# Altium schematic sheet SOC_DDR.schdoc: =
size A3; Symbol: Sheet-Symbol_A4; Company: 嘉立创EDA; Version: V1.0; Page Size: A4; @Project Name: RK3568B2地瓜派; @Page Count: 27; @Update Date: 2025-09-11; @Create Date: 2025-09-11; @Schematic Name: Schematic1; @Page No: 6; @Page Name: SOC_DDR; Device: Sheet-Symbol_A4; Border: 1; Title Block Position: 3; Width: 1655; Height: 1170; Region Start: 1; X Region Count: 6; Y Region Count: 4; Blade Width: 10; @Board Name: Board1; @Create Time: 22:14:45; @Update Time: 22:15:05; Organization: ORGANIZATION; Address1: ADDRESS 1; Address2: ADDRESS 2; Address3: ADDRESS 3; Address4: ADDRESS 4; SheetNumber: 11; SheetTotal: 28
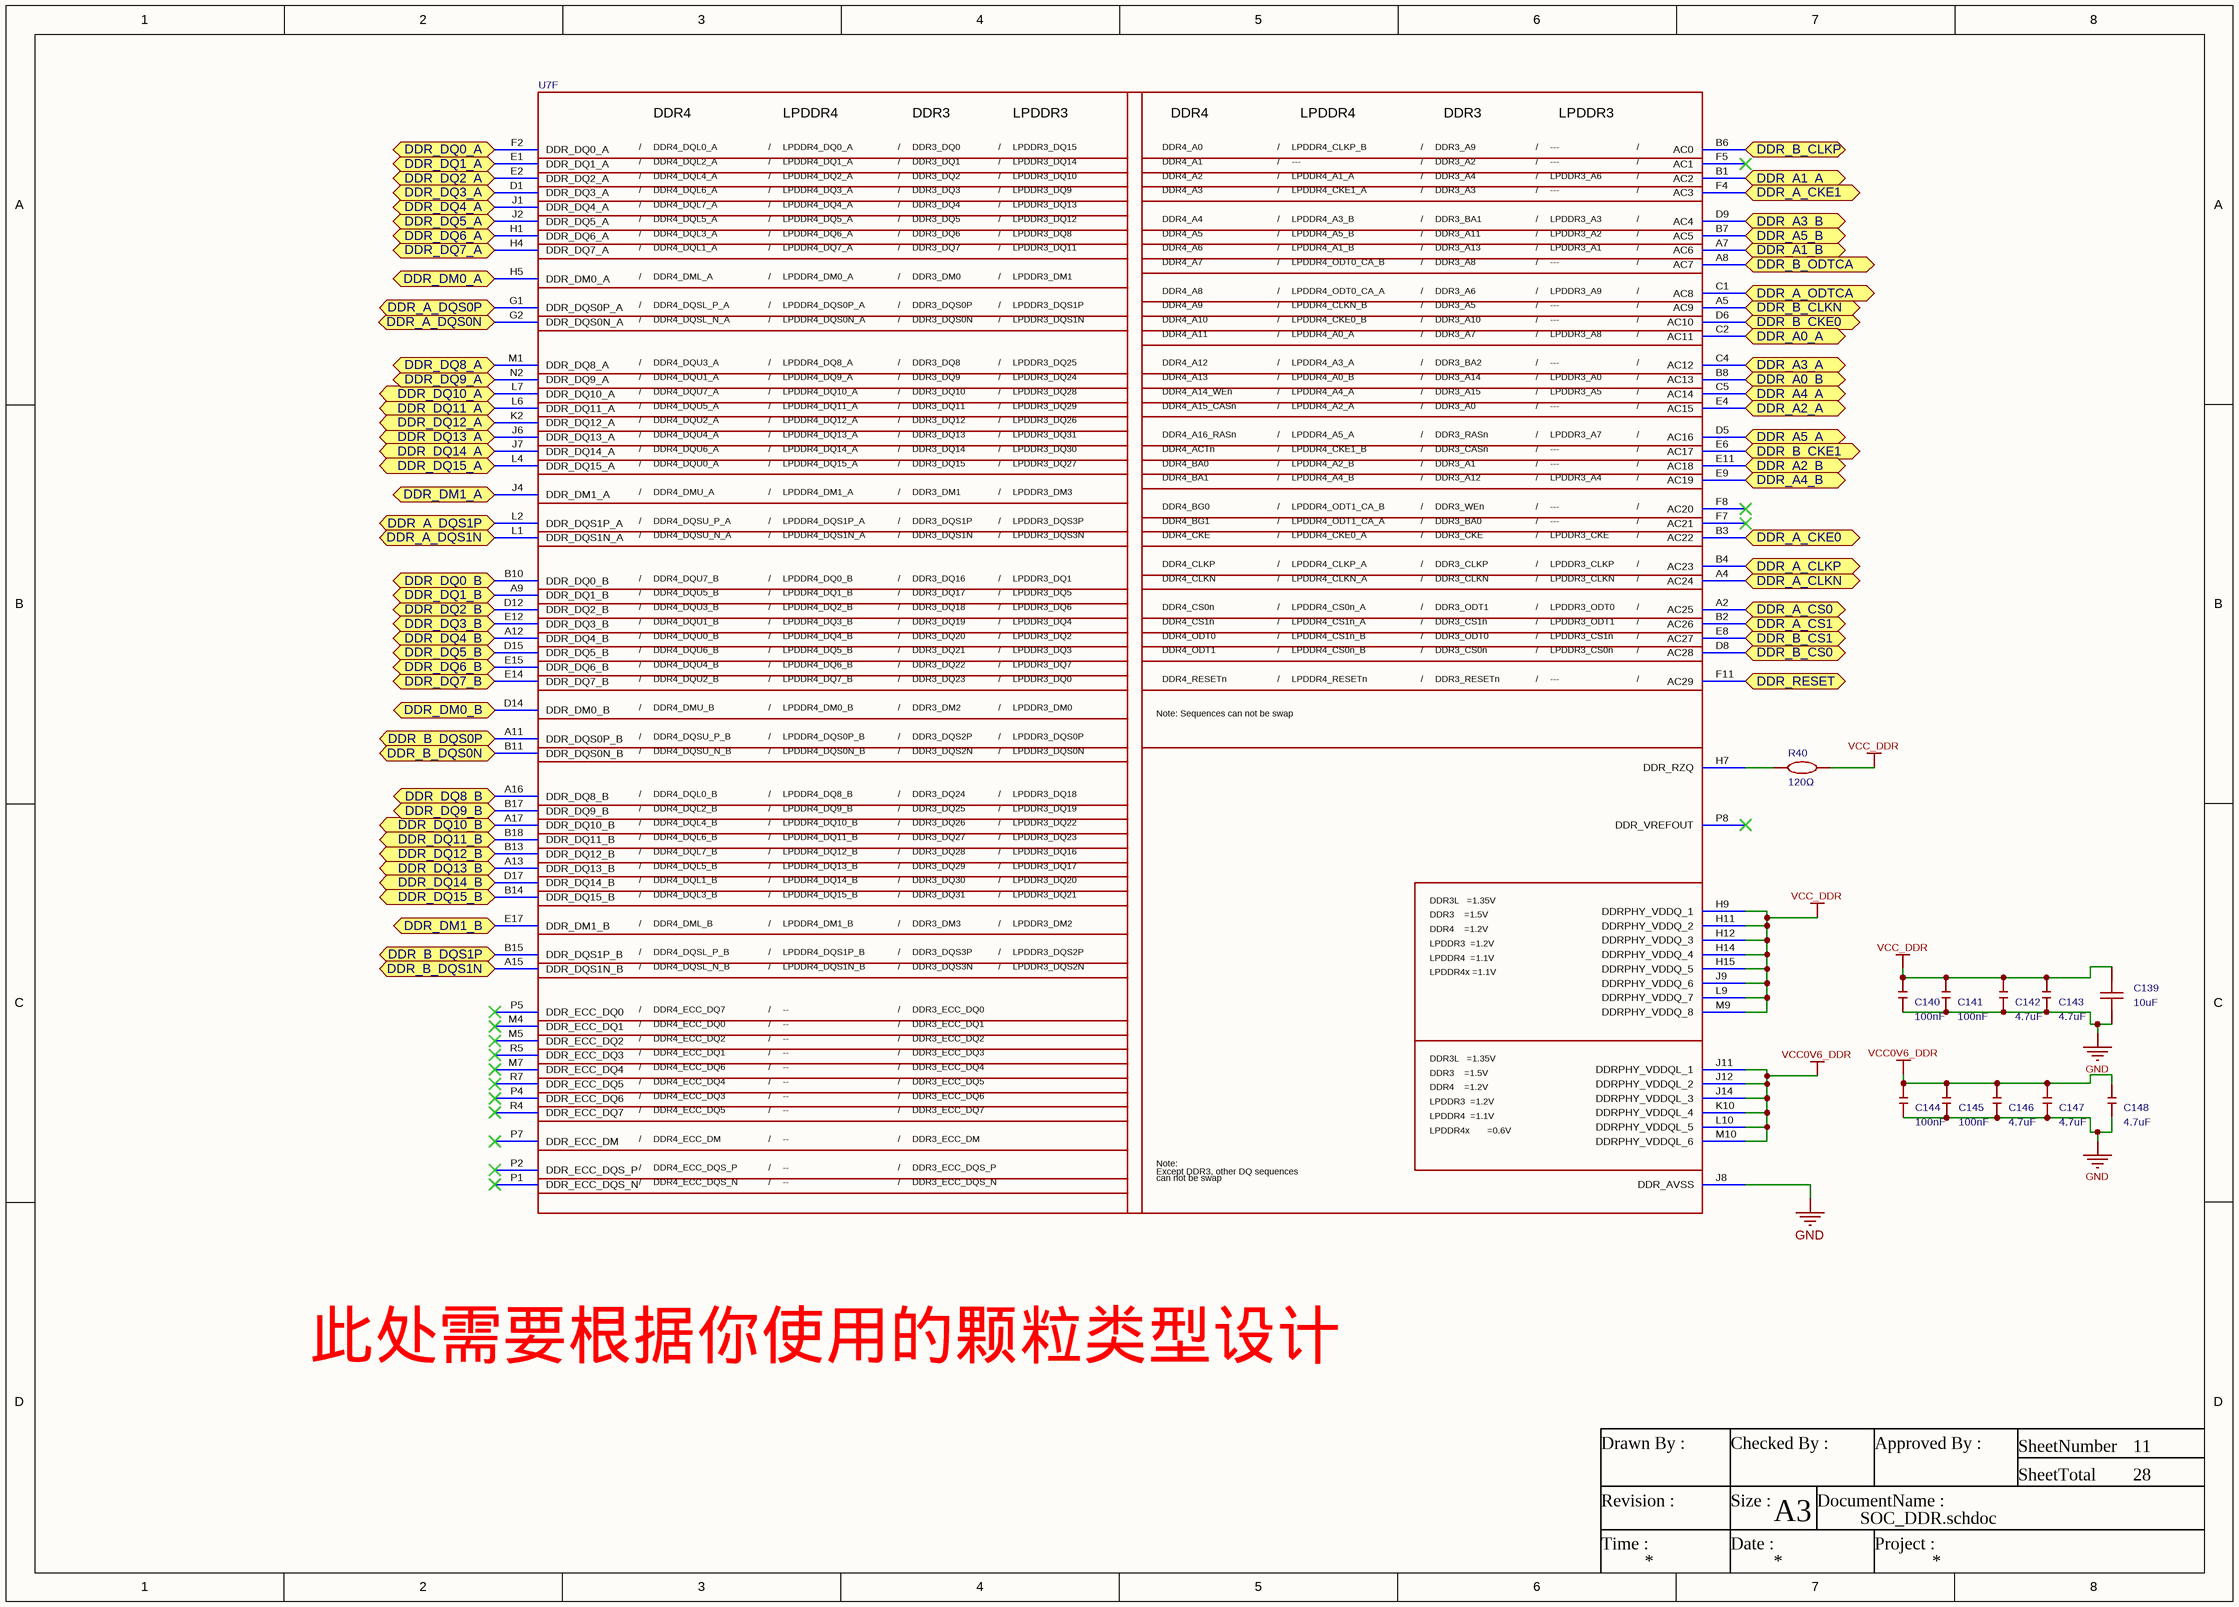
[diagram p0: SOC_DDR.schdoc]

## Parts
C139  10uF  [C0603]
C140  100nF  [MYC0201]
C141  100nF  [MYC0201]
C142  4.7uF  [MYC0402]
C143  4.7uF  [MYC0402]
C144  100nF  [MYC0201]
C145  100nF  [MYC0201]
C146  4.7uF  [MYC0402]
C147  4.7uF  [MYC0402]
C148  4.7uF  [MYC0402]
R40  120Ω  [R0201]
U7  RK3568  [BGA-636_L19.0-W19.0-P0.65-BL]  (value not drawn)  (part F of 23)

## Ports
DDR_A0_A (bidir), DDR_A0_B (bidir), DDR_A1_A (bidir), DDR_A1_B (bidir), DDR_A2_A (bidir), DDR_A2_B (bidir), DDR_A3_A (bidir), DDR_A3_B (bidir), DDR_A4_A (bidir), DDR_A4_B (bidir), DDR_A5_A (bidir), DDR_A5_B (bidir), DDR_A_CKE0 (bidir), DDR_A_CKE1 (bidir), DDR_A_CLKN (bidir), DDR_A_CLKP (bidir), DDR_A_CS0 (bidir), DDR_A_CS1 (bidir), DDR_A_DQS0N (bidir), DDR_A_DQS0P (bidir), DDR_A_DQS1N (bidir), DDR_A_DQS1P (bidir), DDR_A_ODTCA (bidir), DDR_B_CKE0 (bidir), DDR_B_CKE1 (bidir), DDR_B_CLKN (bidir), DDR_B_CLKP (bidir), DDR_B_CS0 (bidir), DDR_B_CS1 (bidir), DDR_B_DQS0N (bidir), DDR_B_DQS0P (bidir), DDR_B_DQS1N (bidir), DDR_B_DQS1P (bidir), DDR_B_ODTCA (bidir), DDR_DM0_A (bidir), DDR_DM0_B (bidir), DDR_DM1_A (bidir), DDR_DM1_B (bidir), DDR_DQ0_A (bidir), DDR_DQ0_B (bidir), DDR_DQ1_A (bidir), DDR_DQ1_B (bidir), DDR_DQ2_A (bidir), DDR_DQ2_B (bidir), DDR_DQ3_A (bidir), DDR_DQ3_B (bidir), DDR_DQ4_A (bidir), DDR_DQ4_B (bidir), DDR_DQ5_A (bidir), DDR_DQ5_B (bidir), DDR_DQ6_A (bidir), DDR_DQ6_B (bidir), DDR_DQ7_A (bidir), DDR_DQ7_B (bidir), DDR_DQ8_A (bidir), DDR_DQ8_B (bidir), DDR_DQ9_A (bidir), DDR_DQ9_B (bidir), DDR_DQ10_A (bidir), DDR_DQ10_B (bidir), DDR_DQ11_A (bidir), DDR_DQ11_B (bidir), DDR_DQ12_A (bidir), DDR_DQ12_B (bidir), DDR_DQ13_A (bidir), DDR_DQ13_B (bidir), DDR_DQ14_A (bidir), DDR_DQ14_B (bidir), DDR_DQ15_A (bidir), DDR_DQ15_B (bidir), DDR_RESET (bidir)

## Nets
GND: C139.1 C140.1 C141.1 C142.1 C143.1 C144.1 C145.1 C146.1 C147.1 C148.1 U7.J8(DDR_AVSS)
VCC0V6_DDR: C144.2 C145.2 C146.2 C147.2 C148.2 U7.J11(DDRPHY_VDDQL_1) U7.J12(DDRPHY_VDDQL_2) U7.J14(DDRPHY_VDDQL_3) U7.K10(DDRPHY_VDDQL_4) U7.L10(DDRPHY_VDDQL_5) U7.M10(DDRPHY_VDDQL_6)
VCC_DDR: C139.2 C140.2 C141.2 C142.2 C143.2 R40.2 U7.H9(DDRPHY_VDDQ_1) U7.H11(DDRPHY_VDDQ_2) U7.H12(DDRPHY_VDDQ_3) U7.H14(DDRPHY_VDDQ_4) U7.H15(DDRPHY_VDDQ_5) U7.J9(DDRPHY_VDDQ_6) U7.L9(DDRPHY_VDDQ_7) U7.M9(DDRPHY_VDDQ_8)
DDR_A0_A: U7.C2(AC11) ; port DDR_A0_A
DDR_A0_B: U7.B8(AC13) ; port DDR_A0_B
DDR_A1_A: U7.B1(AC2) ; port DDR_A1_A
DDR_A1_B: U7.A7(AC6) ; port DDR_A1_B
DDR_A2_A: U7.E4(AC15) ; port DDR_A2_A
DDR_A2_B: U7.E11(AC18) ; port DDR_A2_B
DDR_A3_A: U7.C4(AC12) ; port DDR_A3_A
DDR_A3_B: U7.D9(AC4) ; port DDR_A3_B
DDR_A4_A: U7.C5(AC14) ; port DDR_A4_A
DDR_A4_B: U7.E9(AC19) ; port DDR_A4_B
DDR_A5_A: U7.D5(AC16) ; port DDR_A5_A
DDR_A5_B: U7.B7(AC5) ; port DDR_A5_B
DDR_A_CKE0: U7.B3(AC22) ; port DDR_A_CKE0
DDR_A_CKE1: U7.F4(AC3) ; port DDR_A_CKE1
DDR_A_CLKN: U7.A4(AC24) ; port DDR_A_CLKN
DDR_A_CLKP: U7.B4(AC23) ; port DDR_A_CLKP
DDR_A_CS0: U7.A2(AC25) ; port DDR_A_CS0
DDR_A_CS1: U7.B2(AC26) ; port DDR_A_CS1
DDR_A_DQS0N: U7.G2(DDR_DQS0N_A) ; port DDR_A_DQS0N
DDR_A_DQS0P: U7.G1(DDR_DQS0P_A) ; port DDR_A_DQS0P
DDR_A_DQS1N: U7.L1(DDR_DQS1N_A) ; port DDR_A_DQS1N
DDR_A_DQS1P: U7.L2(DDR_DQS1P_A) ; port DDR_A_DQS1P
DDR_A_ODTCA: U7.C1(AC8) ; port DDR_A_ODTCA
DDR_B_CKE0: U7.D6(AC10) ; port DDR_B_CKE0
DDR_B_CKE1: U7.E6(AC17) ; port DDR_B_CKE1
DDR_B_CLKN: U7.A5(AC9) ; port DDR_B_CLKN
DDR_B_CLKP: U7.B6(AC0) ; port DDR_B_CLKP
DDR_B_CS0: U7.D8(AC28) ; port DDR_B_CS0
DDR_B_CS1: U7.E8(AC27) ; port DDR_B_CS1
DDR_B_DQS0N: U7.B11(DDR_DQS0N_B) ; port DDR_B_DQS0N
DDR_B_DQS0P: U7.A11(DDR_DQS0P_B) ; port DDR_B_DQS0P
DDR_B_DQS1N: U7.A15(DDR_DQS1N_B) ; port DDR_B_DQS1N
DDR_B_DQS1P: U7.B15(DDR_DQS1P_B) ; port DDR_B_DQS1P
DDR_B_ODTCA: U7.A8(AC7) ; port DDR_B_ODTCA
DDR_DM0_A: U7.H5(DDR_DM0_A) ; port DDR_DM0_A
DDR_DM0_B: U7.D14(DDR_DM0_B) ; port DDR_DM0_B
DDR_DM1_A: U7.J4(DDR_DM1_A) ; port DDR_DM1_A
DDR_DM1_B: U7.E17(DDR_DM1_B) ; port DDR_DM1_B
DDR_DQ0_A: U7.F2(DDR_DQ0_A) ; port DDR_DQ0_A
DDR_DQ0_B: U7.B10(DDR_DQ0_B) ; port DDR_DQ0_B
DDR_DQ1_A: U7.E1(DDR_DQ1_A) ; port DDR_DQ1_A
DDR_DQ1_B: U7.A9(DDR_DQ1_B) ; port DDR_DQ1_B
DDR_DQ2_A: U7.E2(DDR_DQ2_A) ; port DDR_DQ2_A
DDR_DQ2_B: U7.D12(DDR_DQ2_B) ; port DDR_DQ2_B
DDR_DQ3_A: U7.D1(DDR_DQ3_A) ; port DDR_DQ3_A
DDR_DQ3_B: U7.E12(DDR_DQ3_B) ; port DDR_DQ3_B
DDR_DQ4_A: U7.J1(DDR_DQ4_A) ; port DDR_DQ4_A
DDR_DQ4_B: U7.A12(DDR_DQ4_B) ; port DDR_DQ4_B
DDR_DQ5_A: U7.J2(DDR_DQ5_A) ; port DDR_DQ5_A
DDR_DQ5_B: U7.D15(DDR_DQ5_B) ; port DDR_DQ5_B
DDR_DQ6_A: U7.H1(DDR_DQ6_A) ; port DDR_DQ6_A
DDR_DQ6_B: U7.E15(DDR_DQ6_B) ; port DDR_DQ6_B
DDR_DQ7_A: U7.H4(DDR_DQ7_A) ; port DDR_DQ7_A
DDR_DQ7_B: U7.E14(DDR_DQ7_B) ; port DDR_DQ7_B
DDR_DQ8_A: U7.M1(DDR_DQ8_A) ; port DDR_DQ8_A
DDR_DQ8_B: U7.A16(DDR_DQ8_B) ; port DDR_DQ8_B
DDR_DQ9_A: U7.N2(DDR_DQ9_A) ; port DDR_DQ9_A
DDR_DQ9_B: U7.B17(DDR_DQ9_B) ; port DDR_DQ9_B
DDR_DQ10_A: U7.L7(DDR_DQ10_A) ; port DDR_DQ10_A
DDR_DQ10_B: U7.A17(DDR_DQ10_B) ; port DDR_DQ10_B
DDR_DQ11_A: U7.L6(DDR_DQ11_A) ; port DDR_DQ11_A
DDR_DQ11_B: U7.B18(DDR_DQ11_B) ; port DDR_DQ11_B
DDR_DQ12_A: U7.K2(DDR_DQ12_A) ; port DDR_DQ12_A
DDR_DQ12_B: U7.B13(DDR_DQ12_B) ; port DDR_DQ12_B
DDR_DQ13_A: U7.J6(DDR_DQ13_A) ; port DDR_DQ13_A
DDR_DQ13_B: U7.A13(DDR_DQ13_B) ; port DDR_DQ13_B
DDR_DQ14_A: U7.J7(DDR_DQ14_A) ; port DDR_DQ14_A
DDR_DQ14_B: U7.D17(DDR_DQ14_B) ; port DDR_DQ14_B
DDR_DQ15_A: U7.L4(DDR_DQ15_A) ; port DDR_DQ15_A
DDR_DQ15_B: U7.B14(DDR_DQ15_B) ; port DDR_DQ15_B
DDR_RESET: U7.F11(AC29) ; port DDR_RESET
NetR40_1: R40.1 U7.H7(DDR_RZQ)

Not connected (* = marked no-connect by the designer): U7 F5(AC1)* F7(AC21)* F8(AC20)* M4(DDR_ECC_DQ1)* M5(DDR_ECC_DQ2)* M7(DDR_ECC_DQ4)* P1(DDR_ECC_DQS_N)* P2(DDR_ECC_DQS_P)* P4(DDR_ECC_DQ6)* P5(DDR_ECC_DQ0)* P7(DDR_ECC_DM)* P8(DDR_VREFOUT)* R4(DDR_ECC_DQ7)* R5(DDR_ECC_DQ3)* R7(DDR_ECC_DQ5)*

## Notes on the sheet
- 此处需要根据你使用的颗粒类型设计
- Drawn By :
- Checked By :
- Approved By :
- SheetNumber
- SheetTotal
- Revision :
- Time :
- Size :
- Date :
- A3
- DocumentName :
- Project :
- (in symbol RK3568, part F) DDR4; LPDDR4; DDR3; LPDDR3; /; DDR4_DQL0_A; LPDDR4_DQ0_A; DDR3_DQ0; LPDDR3_DQ15; DDR4_A0; LPDDR4_CLKP_B; DDR3_A9; ---; DDR4_DQL2_A; LPDDR4_DQ1_A; DDR3_DQ1; LPDDR3_DQ14; DDR4_A1; DDR3_A2; DDR4_DQL4_A; LPDDR4_DQ2_A; DDR3_DQ2; LPDDR3_DQ10; DDR4_A2; LPDDR4_A1_A; DDR3_A4; LPDDR3_A6; DDR4_DQL6_A; LPDDR4_DQ3_A; DDR3_DQ3; LPDDR3_DQ9; DDR4_A3; LPDDR4_CKE1_A; DDR3_A3; DDR4_DQL7_A; LPDDR4_DQ4_A; DDR3_DQ4; LPDDR3_DQ13; DDR4_DQL5_A; LPDDR4_DQ5_A; DDR3_DQ5; LPDDR3_DQ12; DDR4_A4; LPDDR4_A3_B; DDR3_BA1; LPDDR3_A3; DDR4_DQL3_A; LPDDR4_DQ6_A; DDR3_DQ6; LPDDR3_DQ8; DDR4_A5; LPDDR4_A5_B; DDR3_A11; LPDDR3_A2; DDR4_DQL1_A; LPDDR4_DQ7_A; DDR3_DQ7; LPDDR3_DQ11; DDR4_A6; LPDDR4_A1_B; DDR3_A13; LPDDR3_A1; DDR4_A7; LPDDR4_ODT0_CA_B; DDR3_A8; DDR4_DML_A; LPDDR4_DM0_A; DDR3_DM0; LPDDR3_DM1; DDR4_A8; LPDDR4_ODT0_CA_A; DDR3_A6; LPDDR3_A9; DDR4_DQSL_P_A; LPDDR4_DQS0P_A; DDR3_DQS0P; LPDDR3_DQS1P; DDR4_A9; LPDDR4_CLKN_B; DDR3_A5; DDR4_DQSL_N_A; LPDDR4_DQS0N_A; DDR3_DQS0N; LPDDR3_DQS1N; DDR4_A10; LPDDR4_CKE0_B; DDR3_A10; DDR4_A11; LPDDR4_A0_A; DDR3_A7; LPDDR3_A8; DDR4_DQU3_A; LPDDR4_DQ8_A; DDR3_DQ8; LPDDR3_DQ25; DDR4_A12; LPDDR4_A3_A; DDR3_BA2; DDR4_DQU1_A; LPDDR4_DQ9_A; DDR3_DQ9; LPDDR3_DQ24; DDR4_A13; LPDDR4_A0_B; DDR3_A14; LPDDR3_A0; DDR4_DQU7_A; LPDDR4_DQ10_A; DDR3_DQ10; LPDDR3_DQ28; DDR4_A14_WEn; LPDDR4_A4_A; DDR3_A15; LPDDR3_A5; DDR4_DQU5_A; LPDDR4_DQ11_A; DDR3_DQ11; LPDDR3_DQ29; DDR4_A15_CASn; LPDDR4_A2_A; DDR3_A0; DDR4_DQU2_A; LPDDR4_DQ12_A; DDR3_DQ12; LPDDR3_DQ26; DDR4_DQU4_A; LPDDR4_DQ13_A; DDR3_DQ13; LPDDR3_DQ31; DDR4_A16_RASn; LPDDR4_A5_A; DDR3_RASn; LPDDR3_A7; DDR4_DQU6_A; LPDDR4_DQ14_A; DDR3_DQ14; LPDDR3_DQ30; DDR4_ACTn; LPDDR4_CKE1_B; DDR3_CASn; DDR4_DQU0_A; LPDDR4_DQ15_A; DDR3_DQ15; LPDDR3_DQ27; DDR4_BA0; LPDDR4_A2_B; DDR3_A1; DDR4_BA1; LPDDR4_A4_B; DDR3_A12; LPDDR3_A4; DDR4_DMU_A; LPDDR4_DM1_A; DDR3_DM1; LPDDR3_DM3; DDR4_BG0; LPDDR4_ODT1_CA_B; DDR3_WEn; DDR4_DQSU_P_A; LPDDR4_DQS1P_A; DDR3_DQS1P; LPDDR3_DQS3P; DDR4_BG1; LPDDR4_ODT1_CA_A; DDR3_BA0; DDR4_DQSU_N_A; LPDDR4_DQS1N_A; DDR3_DQS1N; LPDDR3_DQS3N; DDR4_CKE; LPDDR4_CKE0_A; DDR3_CKE; LPDDR3_CKE; DDR4_CLKP; LPDDR4_CLKP_A; DDR3_CLKP; LPDDR3_CLKP; DDR4_DQU7_B; LPDDR4_DQ0_B; DDR3_DQ16; LPDDR3_DQ1; DDR4_CLKN; LPDDR4_CLKN_A; DDR3_CLKN; LPDDR3_CLKN; DDR4_DQU5_B; LPDDR4_DQ1_B; DDR3_DQ17; LPDDR3_DQ5; DDR4_DQU3_B; LPDDR4_DQ2_B; DDR3_DQ18; LPDDR3_DQ6; DDR4_CS0n; LPDDR4_CS0n_A; DDR3_ODT1; LPDDR3_ODT0; DDR4_DQU1_B; LPDDR4_DQ3_B; DDR3_DQ19; LPDDR3_DQ4; DDR4_CS1n; LPDDR4_CS1n_A; DDR3_CS1n; LPDDR3_ODT1; DDR4_DQU0_B; LPDDR4_DQ4_B; DDR3_DQ20; LPDDR3_DQ2; DDR4_ODT0; LPDDR4_CS1n_B; DDR3_ODT0; LPDDR3_CS1n; DDR4_DQU6_B; LPDDR4_DQ5_B; DDR3_DQ21; LPDDR3_DQ3; DDR4_ODT1; LPDDR4_CS0n_B; DDR3_CS0n; LPDDR3_CS0n; DDR4_DQU4_B; LPDDR4_DQ6_B; DDR3_DQ22; LPDDR3_DQ7; DDR4_DQU2_B; LPDDR4_DQ7_B; DDR3_DQ23; LPDDR3_DQ0; DDR4_RESETn; LPDDR4_RESETn; DDR3_RESETn; DDR4_DMU_B; LPDDR4_DM0_B; DDR3_DM2; LPDDR3_DM0; Note: Sequences can not be swap; DDR4_DQSU_P_B; LPDDR4_DQS0P_B; DDR3_DQS2P; LPDDR3_DQS0P; DDR4_DQSU_N_B; LPDDR4_DQS0N_B; DDR3_DQS2N; LPDDR3_DQS0N; DDR4_DQL0_B; LPDDR4_DQ8_B; DDR3_DQ24; LPDDR3_DQ18; DDR4_DQL2_B; LPDDR4_DQ9_B; DDR3_DQ25; LPDDR3_DQ19; DDR4_DQL4_B; LPDDR4_DQ10_B; DDR3_DQ26; LPDDR3_DQ22; DDR4_DQL6_B; LPDDR4_DQ11_B; DDR3_DQ27; LPDDR3_DQ23; DDR4_DQL7_B; LPDDR4_DQ12_B; DDR3_DQ28; LPDDR3_DQ16; DDR4_DQL5_B; LPDDR4_DQ13_B; DDR3_DQ29; LPDDR3_DQ17; DDR4_DQL1_B; LPDDR4_DQ14_B; DDR3_DQ30; LPDDR3_DQ20; DDR4_DQL3_B; LPDDR4_DQ15_B; DDR3_DQ31; LPDDR3_DQ21; DDR3L   =1.35V; DDR3    =1.5V; DDR4_DML_B; LPDDR4_DM1_B; DDR3_DM3; LPDDR3_DM2; DDR4    =1.2V; LPDDR3  =1.2V; DDR4_DQSL_P_B; LPDDR4_DQS1P_B; DDR3_DQS3P; LPDDR3_DQS2P; LPDDR4  =1.1V; DDR4_DQSL_N_B; LPDDR4_DQS1N_B; DDR3_DQS3N; LPDDR3_DQS2N; LPDDR4x =1.1V; DDR4_ECC_DQ7; --; DDR3_ECC_DQ0; DDR4_ECC_DQ0; DDR3_ECC_DQ1; DDR4_ECC_DQ2; DDR3_ECC_DQ2; DDR4_ECC_DQ1; DDR3_ECC_DQ3; DDR4_ECC_DQ6; DDR3_ECC_DQ4; DDR4_ECC_DQ4; DDR3_ECC_DQ5; DDR4_ECC_DQ3; DDR3_ECC_DQ6; DDR4_ECC_DQ5; DDR3_ECC_DQ7; LPDDR4x; DDR4_ECC_DM; DDR3_ECC_DM; Note:; DDR4_ECC_DQS_P; DDR3_ECC_DQS_P; Except DDR3, other DQ sequences; can not be swap; DDR4_ECC_DQS_N; DDR3_ECC_DQS_N

## Library data of the parts
C139 = CAP_0603: Symbol: Capacitance; 3D Model: ac125912035d415993ca9572d50418b1聨0819f05c4eef4c71ace90d822a990e87; 3D Model Transform: 62.992,31.496,0,0,0,0,0,0,0; ConvertToPcb: yes; ModelName: C0603_L1.6-W0.8-H0.8; Device: CAP_0603; Supplier Footprint: 0603; Value: 10uF; AddInBom: yes; FootprintName: C0603
C140 C141 C144 C145 = MY_C0201: my0201; AddInBom: yes; ModelId: 7899b263465b4be781422057da338961聨0819f05c4eef4c71ace90d822a990e87; ModelName: C0201; ModelTransform: 23.622000938653944,11.811000469326972,11.811000469326972,0,0,0,0,0,0; Symbol: MY_C0201; Device: MY_C0201; Value: 100nF; FootprintName: MYC0201; ConvertToPcb: yes
C142 C143 C146-C148 = MYC0402: C0402电容; Symbol: MY_C0201; AddInBom: yes; Device: MYC0402; Value: 4.7uF; ConvertToPcb: yes; FootprintName: MYC0402
R40 = Res_0201: Symbol: 电阻; 3D Model: 0e006ba4c37b4b73b0e85d5d1c6800cb; 3D Model Transform: 23.622,11.811,0,0,0,0,0,-0.0005,0; ConvertToPcb: yes; ModelName: R0201_L0.6-W0.3-H0.3; Device: Res_0201; Supplier Footprint: 0201; Value: 120Ω; AddInBom: yes; FootprintName: R0201
U7 = RK3568: ConvertToPcb: yes; ModelId: e6756cba1b9f43448429fdcd1d44d9d9; ModelTransform: 748.03,748.03,54.33,0,0,0,0,0,0; Symbol: RK3568; Device: RK3568; AddInBom: yes; FootprintName: BGA-636_L19.0-W19.0-P0.65-BL; ModelName: BGA-636_L19.0-W19.0-P0.65-BL